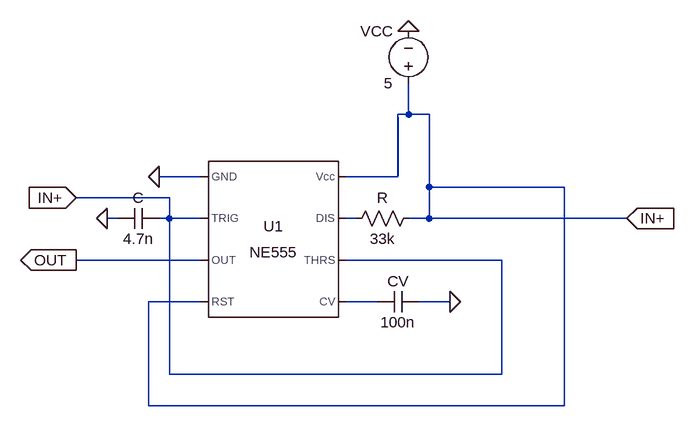
[diagram p0: schematic 555_Circuit.asc]
555_Circuit.asc, the LTspice schematic file:
Version 4
SHEET 1 880 680
WIRE 368 -48 368 -96
WIRE 368 -48 352 -48
WIRE 400 -48 368 -48
WIRE 48 48 -16 48
WIRE 352 48 352 -48
WIRE 352 48 272 48
WIRE 400 64 400 -48
WIRE 608 64 400 64
WIRE 0 80 -144 80
WIRE -80 112 -96 112
WIRE 0 112 0 80
WIRE 0 112 -16 112
WIRE 48 112 0 112
WIRE 288 112 272 112
WIRE 400 112 400 64
WIRE 400 112 368 112
WIRE 704 112 400 112
WIRE 48 176 -144 176
WIRE 512 176 272 176
WIRE 48 240 -32 240
WIRE 320 240 272 240
WIRE 432 240 384 240
WIRE 0 352 0 112
WIRE 512 352 512 176
WIRE 512 352 0 352
WIRE -32 400 -32 240
WIRE 608 400 608 64
WIRE 608 400 -32 400
FLAG 432 240 0
FLAG -16 48 0
FLAG -96 112 0
FLAG 368 -176 0
FLAG -144 80 IN+
IOPIN -144 80 In
FLAG 704 112 IN+
IOPIN 704 112 In
FLAG -144 176 OUT
IOPIN -144 176 Out
SYMBOL Misc\\NE555 160 144 R0
SYMATTR InstName U1
SYMBOL res 384 96 R90
WINDOW 0 0 56 VBottom 2
WINDOW 3 32 56 VTop 2
SYMATTR InstName R
SYMATTR Value 33k
SYMBOL cap 384 224 R90
WINDOW 0 0 32 VBottom 2
WINDOW 3 32 32 VTop 2
SYMATTR InstName CV
SYMATTR Value 100n
SYMBOL cap -16 96 R90
WINDOW 0 0 32 VBottom 2
WINDOW 3 32 32 VTop 2
SYMATTR InstName C
SYMATTR Value 4.7n
SYMBOL voltage 368 -80 R180
WINDOW 0 24 96 Left 2
WINDOW 3 24 16 Left 2
WINDOW 123 0 0 Left 0
WINDOW 39 0 0 Left 0
SYMATTR InstName VCC
SYMATTR Value 5

The netlist it stands for:
* 555_Circuit.asc
XU1 0 IN+ OUT IN+ N002 IN+ N001 IN+ NE555  ; pins GND TRIG OUT RST CV THRS DIS Vcc
R IN+ N001 33k
CV 0 N002 100n
C IN+ 0 4.7n
VCC IN+ 0 5
.lib NE555.sub
.backanno
.end